# EasyEDA Pro project ReuseBlock_opa2450_2024-11-16.epro

# Schematic opa2450
Create Date: 2023-12-28; Page Name: P1; Project Name: OPA2350; Schematic Name: Schematic3; Update Date: 2024-03-03; Company: 嘉立创EDA; Page Size: A4; Version: V1.0
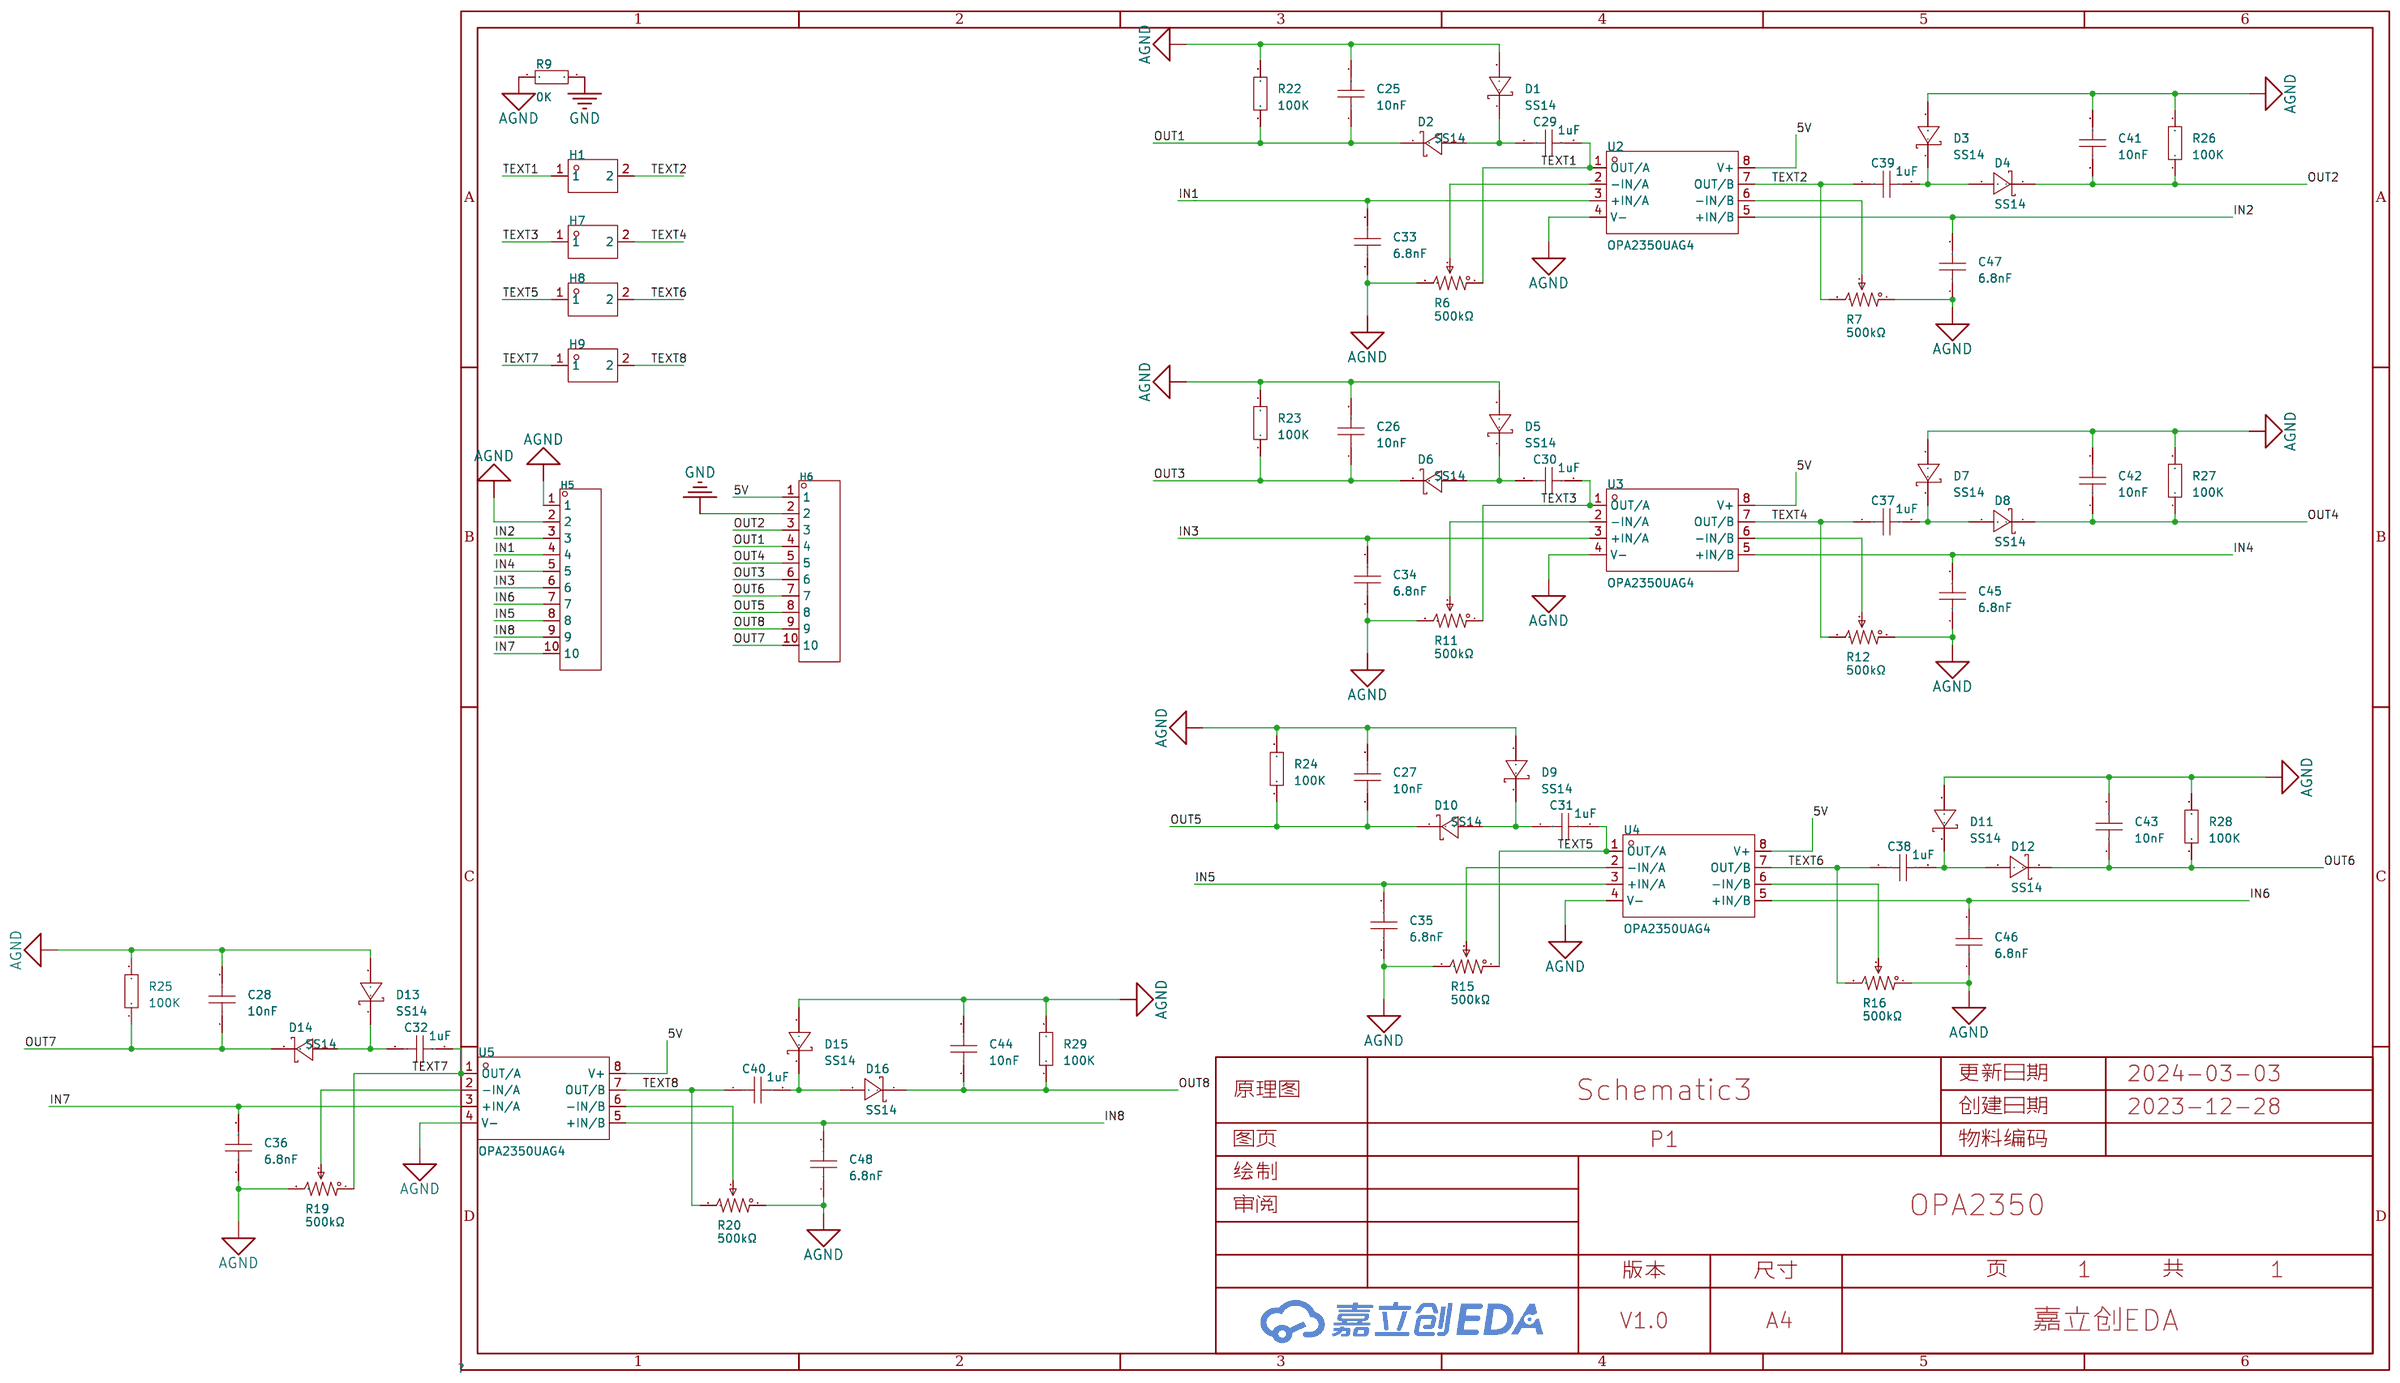
[diagram p0: schematic sheet]

## Parts
C25  10nF  [C0603]
C26  10nF  [C0603]
C27  10nF  [C0603]
C28  10nF  [C0603]
C29  1uF  [C0603]
C30  1uF  [C0603]
C31  1uF  [C0603]
C32  1uF  [C0603]
C33  6.8nF  [C0603]
C34  6.8nF  [C0603]
C35  6.8nF  [C0603]
C36  6.8nF  [C0603]
C37  1uF  [C0603]
C38  1uF  [C0603]
C39  1uF  [C0603]
C40  1uF  [C0603]
C41  10nF  [C0603]
C42  10nF  [C0603]
C43  10nF  [C0603]
C44  10nF  [C0603]
C45  6.8nF  [C0603]
C46  6.8nF  [C0603]
C47  6.8nF  [C0603]
C48  6.8nF  [C0603]
D1  SS14  [SMA_L4.2-W2.6-LS5.3-RD]
D2  SS14  [SMA_L4.2-W2.6-LS5.3-RD]
D3  SS14  [SMA_L4.2-W2.6-LS5.3-RD]
D4  SS14  [SMA_L4.2-W2.6-LS5.3-RD]
D5  SS14  [SMA_L4.2-W2.6-LS5.3-RD]
D6  SS14  [SMA_L4.2-W2.6-LS5.3-RD]
D7  SS14  [SMA_L4.2-W2.6-LS5.3-RD]
D8  SS14  [SMA_L4.2-W2.6-LS5.3-RD]
D9  SS14  [SMA_L4.2-W2.6-LS5.3-RD]
D10  SS14  [SMA_L4.2-W2.6-LS5.3-RD]
D11  SS14  [SMA_L4.2-W2.6-LS5.3-RD]
D12  SS14  [SMA_L4.2-W2.6-LS5.3-RD]
D13  SS14  [SMA_L4.2-W2.6-LS5.3-RD]
D14  SS14  [SMA_L4.2-W2.6-LS5.3-RD]
D15  SS14  [SMA_L4.2-W2.6-LS5.3-RD]
D16  SS14  [SMA_L4.2-W2.6-LS5.3-RD]
H1  -  [HDR-TH_2P-P2.54-V-M-2]
H5  -  [HDR-TH_10P-P2.54-V-M-1]
H6  -  [HDR-TH_10P-P2.54-V-M-1]
H7  -  [HDR-TH_2P-P2.54-V-M-2]
H8  -  [HDR-TH_2P-P2.54-V-M-2]
H9  -  [HDR-TH_2P-P2.54-V-M-2]
R6  500kΩ  [RES-ADJ-TH_3P-L9.5-W4.85-P2.50-BL-BS]
R7  500kΩ  [RES-ADJ-TH_3P-L9.5-W4.85-P2.50-BL-BS]
R9  0K  [R0805]
R11  500kΩ  [RES-ADJ-TH_3P-L9.5-W4.85-P2.50-BL-BS]
R12  500kΩ  [RES-ADJ-TH_3P-L9.5-W4.85-P2.50-BL-BS]
R15  500kΩ  [RES-ADJ-TH_3P-L9.5-W4.85-P2.50-BL-BS]
R16  500kΩ  [RES-ADJ-TH_3P-L9.5-W4.85-P2.50-BL-BS]
R19  500kΩ  [RES-ADJ-TH_3P-L9.5-W4.85-P2.50-BL-BS]
R20  500kΩ  [RES-ADJ-TH_3P-L9.5-W4.85-P2.50-BL-BS]
R22  100K  [R0603]
R23  100K  [R0603]
R24  100K  [R0603]
R25  100K  [R0603]
R26  100K  [R0603]
R27  100K  [R0603]
R28  100K  [R0603]
R29  100K  [R0603]
U2  OPA2350UAG4  [SOIC-8_L4.9-W3.9-P1.27-LS6.0-BL]
U3  OPA2350UAG4  [SOIC-8_L4.9-W3.9-P1.27-LS6.0-BL]
U4  OPA2350UAG4  [SOIC-8_L4.9-W3.9-P1.27-LS6.0-BL]
U5  OPA2350UAG4  [SOIC-8_L4.9-W3.9-P1.27-LS6.0-BL]

## Library data of the parts
C25-C48 = CAP_0603: Supplier Footprint: 0603
D1-D16 = SS14_C2480: 二极管配置:独立式;直流反向耐压(Vr):40V;平均整流电流(Io):1A;正向压降(Vf):550mV@1A;; LCSC Part Name: 电压:40V 电流:1A 框架工艺; Supplier Part: C2480; Manufacturer: MDD; Supplier Footprint: SMA(DO-214AC); JLCPCB Part Class: Basic Part; Datasheet: https://atta.szlcsc.com/upload/public/pdf/source/20230712/2DB6064CFBB99DE6DB116BEE8208BE66.pdf; Supplier: LCSC; Diode Configuration: 独立式; Reverse Voltage (Vr): 40V; Average Rectified Current (Io): 1A; Forward Voltage (Vf@If): 550mV@1A; Reverse Leakage Current (Ir): 500uA@40V
H1 H7-H9 = HDR-M_2.54_2x1: Supplier Part: C2883961; Supplier Footprint: 插件,P=2.54mm
H5 H6 = HDR-M_2.54_1x10P: Supplier Part: C57369; Supplier Footprint: 插件
R6 R7 R11 R12 R15 R16 R19 R20 = 3296W-1-504: 阻值:500kΩ;精度:±10%;; LCSC Part Name: 500kΩ ±10%; Supplier Part: C118921; Manufacturer: BOCHEN(博晨); Supplier Footprint: 插件; Datasheet: https://atta.szlcsc.com/upload/public/pdf/source/20171114/C118921_15106326579491117411.pdf; Supplier: LCSC; Tolerance: ±10%
R9 = Res_0805: Supplier Footprint: 0805
R22-R29 = Res_0603: Supplier Footprint: 0603
U2-U5 = OPA2350UAG4: 双路单电源、轨到轨、高速、低噪声运算放大器 8-SOIC -40 to 85; Supplier Part: C1348173; Manufacturer: TI(德州仪器); Supplier Footprint: SOIC-8; JLCPCB Part Class: Extended Part; Datasheet: https://atta.szlcsc.com/upload/public/pdf/source/20230221/D8B867601B2BBC4CF3C3C4A68F78D01C.pdf; Supplier: LCSC

## Nets
5V: H6.1 U2.8(V+) U3.8(V+) U4.8(V+) U5.8(V+)
AGND: C25.2 C26.2 C27.2 C28.2 C33.1 C34.1 C35.1 C36.1 C41.2 C42.2 C43.2 C44.2 C45.1 C46.1 C47.1 C48.1 D1.2(A) D3.2(A) D5.2(A) D7.2(A) D9.2(A) D11.2(A) D13.2(A) D15.2(A) H5.1 H5.2 R6.3 R7.1 R9.1 R11.3 R12.1 R15.3 R16.1 R19.3 R20.1 R22.2 R23.2 R24.2 R25.2 R26.2 R27.2 R28.2 R29.2 U2.4(V-) U3.4(V-) U4.4(V-) U5.4(V-)
GND: H6.2 R9.2
IN1: C33.2 H5.4 U2.3(+IN/A)
IN2: C47.2 H5.3 U2.5(+IN/B)
IN3: C34.2 H5.6 U3.3(+IN/A)
IN4: C45.2 H5.5 U3.5(+IN/B)
IN5: C35.2 H5.8 U4.3(+IN/A)
IN6: C46.2 H5.7 U4.5(+IN/B)
IN7: C36.2 H5.10 U5.3(+IN/A)
IN8: C48.2 H5.9 U5.5(+IN/B)
OUT1: C25.1 D2.1(K) H6.4 R22.1
OUT2: C41.1 D4.1(K) H6.3 R26.1
OUT3: C26.1 D6.1(K) H6.6 R23.1
OUT4: C42.1 D8.1(K) H6.5 R27.1
OUT5: C27.1 D10.1(K) H6.8 R24.1
OUT6: C43.1 D12.1(K) H6.7 R28.1
OUT7: C28.1 D14.1(K) H6.10 R25.1
OUT8: C44.1 D16.1(K) H6.9 R29.1
TEXT1: C29.2 H1.1 R6.1 U2.1(OUT/A)
TEXT2: C39.1 H1.2 R7.3 U2.7(OUT/B)
TEXT3: C30.2 H7.1 R11.1 U3.1(OUT/A)
TEXT4: C37.1 H7.2 R12.3 U3.7(OUT/B)
TEXT5: C31.2 H8.1 R15.1 U4.1(OUT/A)
TEXT6: C38.1 H8.2 R16.3 U4.7(OUT/B)
TEXT7: C32.2 H9.1 R19.1 U5.1(OUT/A)
TEXT8: C40.1 H9.2 R20.3 U5.7(OUT/B)
$1N721: C29.1 D1.1(K) D2.2(A)
$1N728: R6.2 U2.2(-IN/A)
$1N734: C39.2 D3.1(K) D4.2(A)
$1N738: R7.2 U2.6(-IN/B)
$1N1856: C30.1 D5.1(K) D6.2(A)
$1N1863: R11.2 U3.2(-IN/A)
$1N1869: C37.2 D7.1(K) D8.2(A)
$1N1873: R12.2 U3.6(-IN/B)
$1N2731: C31.1 D9.1(K) D10.2(A)
$1N2738: R15.2 U4.2(-IN/A)
$1N2744: C38.2 D11.1(K) D12.2(A)
$1N2748: R16.2 U4.6(-IN/B)
$1N3269: C32.1 D13.1(K) D14.2(A)
$1N3276: R19.2 U5.2(-IN/A)
$1N3282: C40.2 D15.1(K) D16.2(A)
$1N3286: R20.2 U5.6(-IN/B)

# Board opa2450
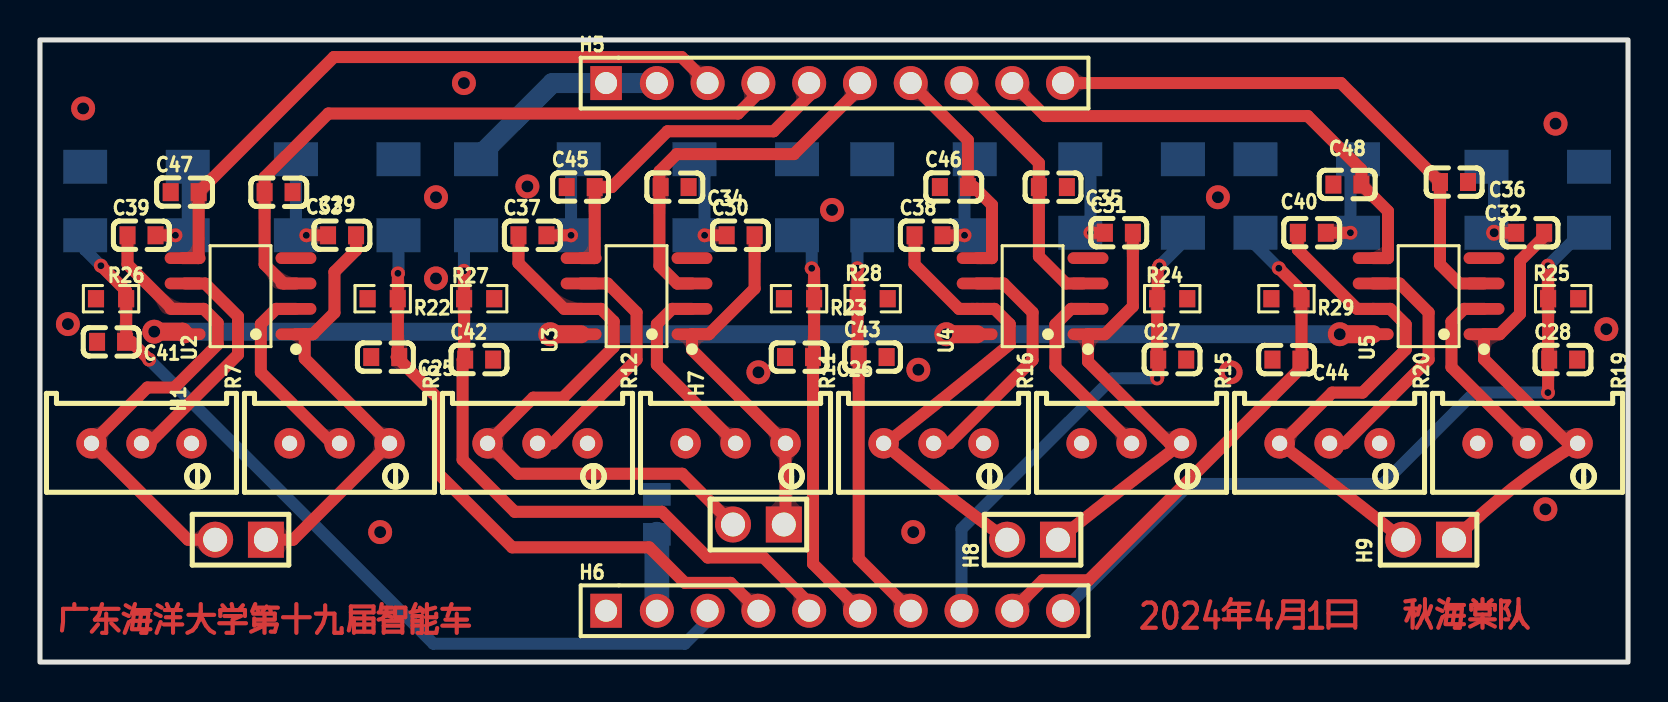
[diagram p1: board, top side]
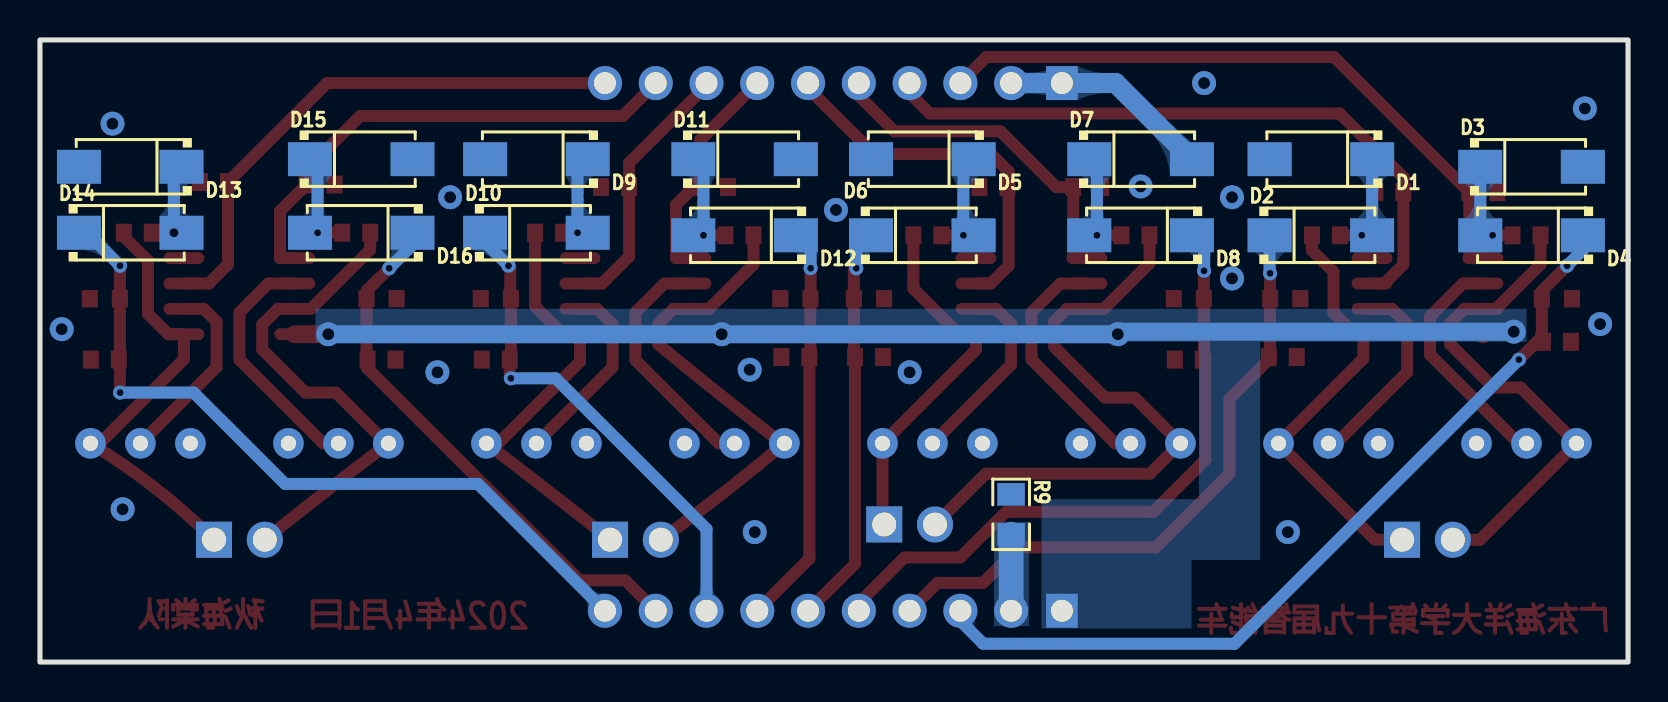
[diagram p2: board, bottom side, seen from below]

Outline 79.44 x 31.14 mm; copper layers: Top Layer, Bottom Layer. Coordinates in mm from the lower left corner of the outline.
Outline path: rectangle 0,31.14 79.44,0
Stack: Top Layer 0.035mm / Dielectric1 1.51mm FR4 er 4.5 / Bottom Layer 0.035mm

## Design rules (mm)
template: JLCPCB Capability(Two Layers Board)
spacing copperThickness1oz (default): track to track 0.102, other pairs 0.152 to 0.3
spacing copperThickness2oz: track to track 0.203, other pairs 0.152 to 0.3
track width copperThickness1oz (default): min 0.127, default 0.254, max 2.54
track width copperThickness2oz: min 0.203, default 0.254, max 2.54
differential pair differentialPair (default): width min 0.127, default 0.254, max 2.54; gap min 0.152, default 0.152
via viaSize (default): diameter min 0.5, default 0.61, max 10; hole min 0.3, default 0.305, max 6.3

## Placement (name value [footprint] x y rotation side)
C25  10nF  [C0603]  17.27 15.27 180 top
C26  10nF  [C0603]  37.97 15.27 180 top
C27  10nF  [C0603]  56.64 15.14 0 top
C28  10nF  [C0603]  76.2 15.14 0 top
C29  1uF  [C0603]  15.11 21.36 0 top
C30  1uF  [C0603]  35.05 21.36 0 top
C31  1uF  [C0603]  53.97 21.49 0 top
C32  1uF  [C0603]  74.55 21.49 0 top
C33  6.8nF  [C0603]  11.94 23.52 180 top
C34  6.8nF  [C0603]  31.75 23.78 180 top
C35  6.8nF  [C0603]  50.67 23.78 180 top
C36  6.8nF  [C0603]  70.74 24.03 180 top
C37  1uF  [C0603]  24.64 21.36 0 top
C38  1uF  [C0603]  44.45 21.36 0 top
C39  1uF  [C0603]  5.08 21.36 0 top
C40  1uF  [C0603]  63.63 21.49 0 top
C41  10nF  [C0603]  3.56 16.03 180 top
C42  10nF  [C0603]  21.97 15.14 0 top
C43  10nF  [C0603]  41.66 15.27 0 top
C44  10nF  [C0603]  62.36 15.14 180 top
C45  6.8nF  [C0603]  27.05 23.78 0 top
C46  6.8nF  [C0603]  45.72 23.78 0 top
C47  6.8nF  [C0603]  7.24 23.52 0 top
C48  6.8nF  [C0603]  65.41 23.9 0 top
D1  SS14  [SMA_L4.2-W2.6-LS5.3-RD]  15.37 25.17 0 bottom
D2  SS14  [SMA_L4.2-W2.6-LS5.3-RD]  15.37 21.36 180 bottom
D3  SS14  [SMA_L4.2-W2.6-LS5.3-RD]  4.83 24.79 180 bottom
D4  SS14  [SMA_L4.2-W2.6-LS5.3-RD]  4.83 21.36 0 bottom
D5  SS14  [SMA_L4.2-W2.6-LS5.3-RD]  35.31 25.17 0 bottom
D6  SS14  [SMA_L4.2-W2.6-LS5.3-RD]  35.31 21.36 180 bottom
D7  SS14  [SMA_L4.2-W2.6-LS5.3-RD]  24.38 25.17 180 bottom
D8  SS14  [SMA_L4.2-W2.6-LS5.3-RD]  24.38 21.36 0 bottom
D9  SS14  [SMA_L4.2-W2.6-LS5.3-RD]  54.61 25.17 0 bottom
D10  SS14  [SMA_L4.2-W2.6-LS5.3-RD]  54.61 21.49 180 bottom
D11  SS14  [SMA_L4.2-W2.6-LS5.3-RD]  44.2 25.17 180 bottom
D12  SS14  [SMA_L4.2-W2.6-LS5.3-RD]  44.2 21.36 0 bottom
D13  SS14  [SMA_L4.2-W2.6-LS5.3-RD]  74.93 24.79 0 bottom
D14  SS14  [SMA_L4.2-W2.6-LS5.3-RD]  74.93 21.49 180 bottom
D15  SS14  [SMA_L4.2-W2.6-LS5.3-RD]  63.37 25.17 180 bottom
D16  SS14  [SMA_L4.2-W2.6-LS5.3-RD]  63.37 21.49 0 bottom
H1  -  [HDR-TH_2P-P2.54-V-M-2]  10.03 6.12 90 top
H5  -  [HDR-TH_10P-P2.54-V-M-1]  39.75 28.98 0 top
H6  -  [HDR-TH_10P-P2.54-V-M-1]  39.75 2.57 0 top
H7  -  [HDR-TH_2P-P2.54-V-M-2]  35.94 6.89 90 top
H8  -  [HDR-TH_2P-P2.54-V-M-2]  49.66 6.12 90 top
H9  -  [HDR-TH_2P-P2.54-V-M-2]  69.47 6.12 90 top
R6  500kΩ  [RES-ADJ-TH_3P-L9.5-W4.85-P2.50-BL-BS]  14.99 10.95 270 top
R7  500kΩ  [RES-ADJ-TH_3P-L9.5-W4.85-P2.50-BL-BS]  5.08 10.95 270 top
R9  0K  [R0805]  30.86 7.39 270 bottom
R11  500kΩ  [RES-ADJ-TH_3P-L9.5-W4.85-P2.50-BL-BS]  34.8 10.95 270 top
R12  500kΩ  [RES-ADJ-TH_3P-L9.5-W4.85-P2.50-BL-BS]  24.89 10.95 270 top
R15  500kΩ  [RES-ADJ-TH_3P-L9.5-W4.85-P2.50-BL-BS]  54.61 10.95 270 top
R16  500kΩ  [RES-ADJ-TH_3P-L9.5-W4.85-P2.50-BL-BS]  44.7 10.95 270 top
R19  500kΩ  [RES-ADJ-TH_3P-L9.5-W4.85-P2.50-BL-BS]  74.42 10.95 270 top
R20  500kΩ  [RES-ADJ-TH_3P-L9.5-W4.85-P2.50-BL-BS]  64.52 10.95 270 top
R22  100K  [R0603]  17.14 18.19 180 top
R23  100K  [R0603]  37.97 18.19 180 top
R24  100K  [R0603]  56.64 18.19 0 top
R25  100K  [R0603]  76.2 18.19 0 top
R26  100K  [R0603]  3.56 18.19 180 top
R27  100K  [R0603]  21.97 18.19 0 top
R28  100K  [R0603]  41.66 18.19 0 top
R29  100K  [R0603]  62.36 18.19 180 top
U2  OPA2350UAG4  [SOIC-8_L4.9-W3.9-P1.27-LS6.0-BL]  10.03 18.32 90 top
U3  OPA2350UAG4  [SOIC-8_L4.9-W3.9-P1.27-LS6.0-BL]  29.84 18.32 90 top
U4  OPA2350UAG4  [SOIC-8_L4.9-W3.9-P1.27-LS6.0-BL]  49.66 18.32 90 top
U5  OPA2350UAG4  [SOIC-8_L4.9-W3.9-P1.27-LS6.0-BL]  69.47 18.32 90 top

## Footprints (pads in the part's own frame, mm; a bottom-side part is the same pattern mirrored in y, then rotated)
C0603
  rect 0.8x0.9 smd: 1(-0.7,0) 2(0.7,0)
HDR-TH_2P-P2.54-V-M-2
  rect 1.8x1.8 hole 1.2: 1(0,-1.27)
  round 1.8 hole 1.2: 2(0,1.27)
HDR-TH_10P-P2.54-V-M-1
  rect 1.575x1.7 hole 1.1: 1(-11.43,0)
  round 1.7 hole 1.1: 2(-8.89,0) 3(-6.35,0) 4(-3.81,0) 5(-1.27,0) 6(1.27,0) 7(3.81,0) 8(6.35,0) 9(8.89,0) 10(11.43,0)
R0603
  rect 0.806x0.864 smd: 1(-0.753,0) 2(0.753,0)
R0805
  rect 1.133x1.377 smd: 1(-1,0) 2(1,0)
RES-ADJ-TH_3P-L9.5-W4.85-P2.50-BL-BS
  round 1.524 hole 0.762: 1(0,2.5) 2(0,0) 3(0,-2.5)
SMA_L4.2-W2.6-LS5.3-RD
  rect 2.2x1.7 smd: 1(-2.566,0) 2(2.566,0)
SOIC-8_L4.9-W3.9-P1.27-LS6.0-BL
  oval 0.588x2.045 smd: 1(-1.905,-2.772) 2(-0.635,-2.772) 3(0.635,-2.772) 4(1.905,-2.772) 5(1.905,2.772) 6(0.635,2.772) 7(-0.635,2.772) 8(-1.905,2.772)

## Nets
As in the schematic.

## Via types
v1: diameter 1.2, hole 0.6, Top Layer to Bottom Layer, 20 vias
v2: diameter 0.7, hole 0.35, Top Layer to Bottom Layer, 18 vias
v3: diameter 0.8, hole 0.45, Top Layer to Bottom Layer, 1 via

## Routing (per net, layer and track width the routed paths; a pad name or vN(x,y) marks a point on that pad's centre or on a via; arc(x,y) is an arc through that point)
5V: length 65.7
  Top Layer w0.9: v1(5.72,16.54) 7.13,16.54 U2.8 ; U5.8 v1(65.02,16.41) ; v1(25.53,16.41) U3.8 ; U4.8 v1(45.34,16.41)
  Bottom Layer w0.9: v1(5.72,16.54) 25.4,16.54 v1(25.53,16.41) v1(45.34,16.41) v1(65.02,16.41)
AGND: length 10.6
  Bottom Layer w1: D7.2 25.63,28.98 H5.1 H5.2
  vias: v1(1.4,16.92) v1(2.16,27.71) v1(17.02,6.51) v1(19.81,23.27) v1(19.81,19.2) v1(21.21,28.98) v1(24.38,23.81) v1(35.94,14.51) v1(39.62,22.63) v1(43.69,6.51) v1(43.94,14.63) v1(58.93,23.27) v1(59.56,14.51) v1(75.31,7.65) v1(75.82,26.95) v1(78.36,16.67)
GND: length 3.8
  Bottom Layer w1.25: H6.2 R9.2
IN1: length 33.3
  Top Layer w0.6: H5.4 35.94,28.48 34.93,27.46 14.42,27.46 11.24,24.27 C33.2 11.24,19.91 12.19,18.95 U2.3
IN2: length 32.9
  Top Layer w0.6: H5.3 32.1,30.29 14.7,30.29 7.94,23.52 7.94,20.22 7.13,20.22
IN3: length 18.8
  Top Layer w0.6: 30.99,23.72 30.99,19.84 31.88,18.95 U3.3 ; 30.99,23.72 C34.2 ; 30.99,23.72 30.99,24.56 31.85,25.43 37.72,25.43 41.02,28.73 H5.6
IN4: length 17.5
  Top Layer w0.6: U3.5 27.75,20.22 C45.2 28.6,23.78 31.39,26.57 36.7,26.57 38.48,28.35 H5.5
IN5: length 13
  Top Layer w0.6: H5.8 46.1,28.86 49.97,24.98 C35.2 49.97,20.31 51.33,18.95 52.18,18.95
IN6: length 11.4
  Top Layer w0.6: H5.7 46.42,26.12 C46.2 46.74,23.78 47.62,22.89 47.62,20.22 U4.5
IN7: length 27.6
  Top Layer w0.6: U5.3 70.99,18.95 70.04,19.91 70.04,24.03 65.09,28.98 H5.10
IN8: length 25
  Top Layer w0.6: U5.5 67.44,20.22 67.44,22.57 C48.2 66.1,24.65 63.43,27.33 50.29,27.33 H5.9
OUT1: length 31.7
  Top Layer w0.6: 17.91,18.2 17.91,15.33 17.84,15.27 19.94,13.17 19.94,9.43 23.62,5.74 30.48,5.74 32.26,3.97 34.54,3.97 H6.4 ; 17.91,18.2 v2(17.91,19.46) ; 17.91,18.2 R22.1
  Bottom Layer w0.6: D2.1 17.93,19.48 v2(17.91,19.46)
OUT2: length 42.6
  Top Layer w0.6: v2(5.46,15.14) 4.57,16.03 C41.1 4.31,16.08 R26.1 4.31,18.58 v2(3.05,19.84)
  Bottom Layer w0.6: v2(3.05,19.84) 2.26,20.63 D4.1 ; v2(5.46,15.14) 19.69,0.92 32.26,0.92 33.4,2.06 H6.3
OUT3: length 20.1
  Top Layer w0.6: v2(38.61,19.71) 38.73,19.59 R23.1 38.73,15.32 38.67,15.27 38.67,4.92 H6.6
  Bottom Layer w0.6: D6.1 38.61,20.63 v2(38.61,19.71)
OUT4: length 32.2
  Top Layer w0.6: v2(21.21,19.59) 21.22,19.58 R27.1 21.22,15.21 21.14,15.14 21.14,10.13 23.75,7.52 31.12,7.52 33.4,5.23 36.19,5.23 38.48,2.95 H6.5
  Bottom Layer w0.6: D8.1 21.21,20.75 v2(21.21,19.59)
OUT5: length 24.8
  Top Layer w0.6: v2(56.01,19.84) 55.91,19.75 55.91,18.34 55.88,18.31 ; R24.1 55.89,15.19 C27.1 55.94,14.26 v2(55.89,14.2)
  Bottom Layer w0.6: H6.8 46.1,6.66 53.64,14.2 v2(55.89,14.2) ; v2(56.01,19.84) 57.18,21.01 D10.1
OUT6: length 20.2
  Top Layer w0.6: v2(40.89,19.71) 40.89,18.2 R28.1 40.9,15.32 C43.1 40.96,5.17 H6.7
  Bottom Layer w0.6: D12.1 40.89,20.63 v2(40.89,19.71)
OUT7: length 38
  Top Layer w0.6: v2(75.44,19.84) 75.45,19.83 R25.1 75.45,15.19 ; v2(75.44,13.49) 75.45,13.5 75.45,15.19 ; 75.45,15.19 C28.1
  Bottom Layer w0.6: v2(75.44,19.84) 77.09,21.49 D14.1 ; H6.10 57.53,8.92 67.18,8.92 71.75,13.49 v2(75.44,13.49)
OUT8: length 27.2
  Top Layer w0.6: H6.9 50.16,4.09 52.45,4.09 63.06,14.7 C44.1 63.11,15.19 R29.1 63.11,18.58 v2(61.98,19.71)
  Bottom Layer w0.6: v2(61.98,19.71) 60.81,20.88 D16.1
TEXT1: length 22.1
  Top Layer w0.6: 13.24,16.41 13.65,16.41 14.73,17.49 14.73,19.53 15.81,20.61 C29.2 ; 13.24,16.41 U2.1 ; 13.24,16.41 13.24,15.19 R6.1 12.66,6.12 H1.1
TEXT2: length 24.8
  Top Layer w0.6: C39.1 4.38,19.91 6.6,17.68 U2.7 8.19,17.68 8.89,16.98 8.89,15.9 6.73,13.74 5.37,13.74 R7.3 7.41,6.12 8.76,6.12
TEXT3: length 18.2
  Top Layer w0.6: C30.2 35.75,18.7 33.47,16.41 U3.1 32.62,15.63 R11.1 37.3,6.97 37.21,6.89
TEXT4: length 30.9
  Top Layer w0.6: C37.1 23.94,19.97 26.22,17.68 U3.7 28.07,17.68 28.7,17.05 28.7,15.78 26.16,13.24 24.68,13.24 R12.3 23.92,9.43 32.13,9.43 H7.2
TEXT5: length 22.1
  Top Layer w0.6: 50.93,6.12 arc(54,8.56) R15.1 56.51,10.95 52.43,15.04 U4.1 53.28,16.41 54.68,17.81 C31.2
TEXT6: length 24.2
  Top Layer w0.6: H8.2 arc(45.25,8.48) R16.3 ; 42.33,10.95 arc(45.44,13.41) 48.51,15.9 48.51,16.92 47.75,17.68 U4.7 45.97,17.68 43.75,19.91 C38.1
TEXT7: length 22.3
  Top Layer w0.6: H9.1 arc(73.69,8.72) R19.1 76.45,10.95 72.24,15.16 U5.1 73.03,16.41 74.04,17.43 74.04,20.09 75.25,21.3 C32.2
TEXT8: length 25.1
  Top Layer w0.6: H9.2 arc(65.12,8.56) R20.3 62.1,10.95 64.64,13.49 66.17,13.49 68.33,15.65 68.33,16.9 67.54,17.68 U5.7 65.89,17.68 62.93,20.64 62.93,21.49
$1N721: length 4.9
  Top Layer w0.6: v2(13.32,21.36) C29.1
  Bottom Layer w0.6: D1.1 D2.2
$1N728: length 9.9
  Top Layer w0.6: R6.2 14.61,10.95 11.05,14.51 11.05,16.92 11.81,17.68 U2.2
$1N734: length 4.8
  Top Layer w0.6: C39.2 v2(6.77,21.36)
  Bottom Layer w0.6: 7.39,25.17 D4.2
$1N738: length 11.9
  Top Layer w0.6: U2.6 8.25,18.95 9.91,17.3 9.91,15.4 5.46,10.95 R7.2
$1N1856: length 5.1
  Top Layer w0.6: v2(33.25,21.36) C30.1
  Bottom Layer w0.6: D5.1 33.25,24.67 v2(33.25,21.36)
$1N1863: length 9.7
  Top Layer w0.6: U3.2 31.62,17.68 30.86,16.92 30.86,14.89 R11.2
$1N1869: length 5.2
  Top Layer w0.6: C37.2 v2(26.57,21.36)
  Bottom Layer w0.6: D7.1 26.57,24.79 v2(26.57,21.36)
$1N1873: length 12.4
  Top Layer w0.6: R12.2 25.65,10.95 29.84,15.14 29.84,17.5 28.4,18.95 U3.6
$1N2731: length 4.6
  Top Layer w0.6: v2(52.55,21.49) C31.1
  Bottom Layer w0.6: v2(52.55,21.49) 52.55,24.67 D9.1
$1N2738: length 9.5
  Top Layer w0.6: U4.2 51.58,17.68 50.8,16.9 50.8,14.76 R15.2
$1N2744: length 5.1
  Top Layer w0.6: v2(46.25,21.36) C38.2
  Bottom Layer w0.6: D11.1 46.25,24.67 v2(46.25,21.36)
$1N2748: length 12.4
  Top Layer w0.6: U4.6 48.21,18.95 49.66,17.5 49.66,15.12 45.49,10.95 R16.2
$1N3269: length 4.9
  Top Layer w0.6: v3(72.75,21.49) C32.1
  Bottom Layer w0.6: v3(72.75,21.49) 72.75,24.44 72.36,24.82 72.36,25.17
$1N3276: length 9.6
  Top Layer w0.6: U5.2 71.25,17.68 70.61,17.05 70.61,14.76 R19.2
$1N3282: length 5.1
  Top Layer w0.6: v2(65.56,21.49) C40.2
  Bottom Layer w0.6: D15.1 65.56,24.79 v2(65.56,21.49)
$1N3286: length 12.4
  Top Layer w0.6: R20.2 65.28,10.95 69.47,15.14 69.47,17.5 68.02,18.95 U5.6

## Copper pours and planes (outline as drawn; the poured copper is in the pictures)
5V on Bottom Layer: 18.4,17.68 29.34,17.68 29.34,1.68 18.4,1.68
5V on Bottom Layer: 5.08,17.68 65.66,17.68 65.66,16.03 5.08,16.03
AGND on Top Layer: -1.91,33.18 82.42,33.18 82.42,-1.5 -1.91,-1.5
AGND on Bottom Layer: -3.17,34.83 84.58,34.83 84.58,-3.02 -3.17,-3.02
GND on Bottom Layer: 29.97,7.01 31.72,7.01 31.72,1.8 29.97,1.8

Small or netless copper shapes (teardrops, artwork), in the pictures only: 113 on Top Layer, 32 on Bottom Layer

## Text on the board
Top Layer: 广东海洋大学第十九届智能车 | 2024年4月1日 | 秋海棠队
